# Altium schematic sheet dacOut.SchDoc
size A4
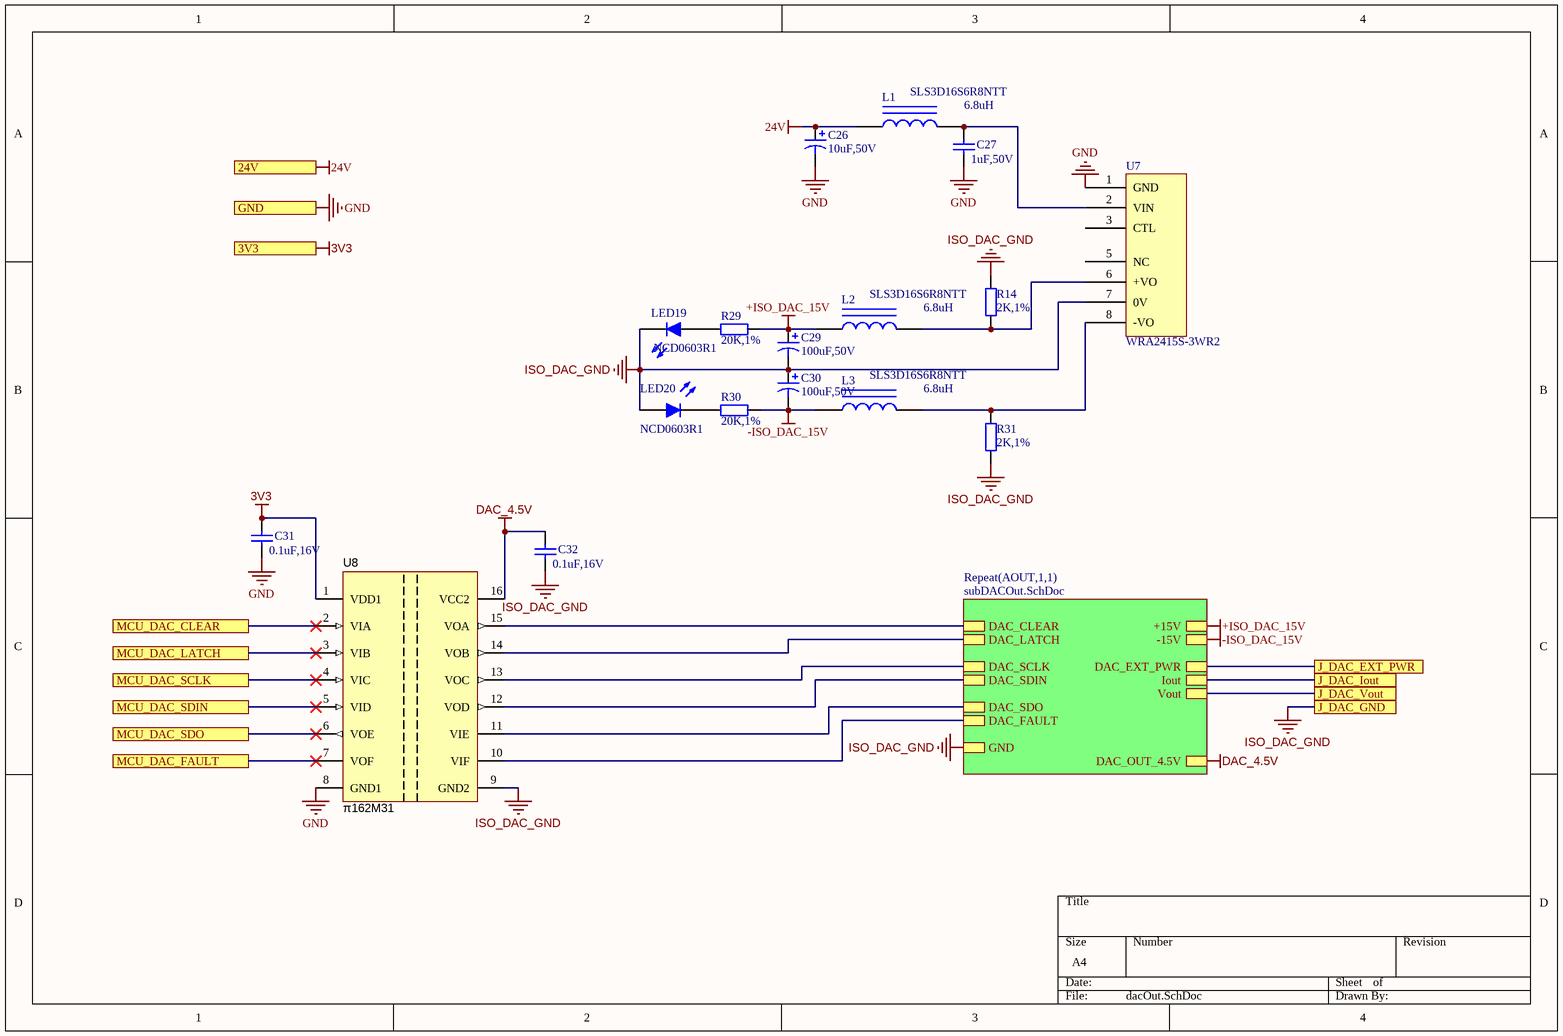
[diagram p0: dacOut.SchDoc]

## Parts
C26  10uF,50V  [CAP-TH_BD5.0-P2.00-D0.8-FD]
C27  1uF,50V  [C0603]
C29  100uF,50V  [CAP-TH_BD6.3-P2.50-D1.0-FD]
C30  100uF,50V  [CAP-TH_BD6.3-P2.50-D1.0-FD]
C31  0.1uF,16V  [C0603]
C32  0.1uF,16V  [C0603]
L1  SLS3D16S6R8NTT  value 6.8uH  [IND-SMD_L4.0-W4.0_SLS3DXX]
L2  SLS3D16S6R8NTT  value 6.8uH  [IND-SMD_L4.0-W4.0_SLS3DXX]
L3  SLS3D16S6R8NTT  value 6.8uH  [IND-SMD_L4.0-W4.0_SLS3DXX]
LED19  NCD0603R1  [LED0603-RD]
LED20  NCD0603R1  [LED0603-RD]
R14  2K,1%  [R0603]
R29  20K,1%  [R0603]
R30  20K,1%  [R0603]
R31  2K,1%  [R0603]
U7  WRA2415S-3WR2  [PWRM-TH_WRA2415S-3WR2]
U8  π162M31  [SOIC-16_L9.9-W3.9-P1.27-LS6.0-BL]

## Sub-sheets
Repeat(AOUT,1,1) = subDACOut.SchDoc: GND, Vout, -15V, +15V, DAC_EXT_PWR, Iout, DAC_OUT_4.5V, DAC_CLEAR, DAC_LATCH, DAC_FAULT, DAC_SDO, DAC_SCLK, DAC_SDIN

## Ports
3V3, 24V, GND, J_DAC_EXT_PWR, J_DAC_GND, J_DAC_Iout, J_DAC_Vout, MCU_DAC_CLEAR, MCU_DAC_FAULT, MCU_DAC_LATCH, MCU_DAC_SCLK, MCU_DAC_SDIN, MCU_DAC_SDO

## Nets
3V3: C31.2 U8.1(VDD1) ; port 3V3
24V: C26.1 L1.1 ; port 24V
+ISO_DAC_15V: C29.1 L2.1 R29.2 ; sheet Repeat(AOUT,1,1)/+15V
-ISO_DAC_15V: C30.2 L3.1 R30.2 ; sheet Repeat(AOUT,1,1)/-15V
DAC_4.5V: C32.2 U8.16(VCC2) ; sheet Repeat(AOUT,1,1)/DAC_OUT_4.5V
GND: C26.2 C27.1 C31.1 U7.1(GND) U8.8(GND1) ; port GND
ISO_DAC_GND: C29.2 C30.1 C32.1 LED19.1(K) LED20.2(A) R14.2 R31.1 U7.7(0V) U8.9(GND2) ; port J_DAC_GND, sheet Repeat(AOUT,1,1)/GND
J_DAC_EXT_PWR: port J_DAC_EXT_PWR, sheet Repeat(AOUT,1,1)/DAC_EXT_PWR
J_DAC_Iout: port J_DAC_Iout, sheet Repeat(AOUT,1,1)/Iout
J_DAC_Vout: port J_DAC_Vout, sheet Repeat(AOUT,1,1)/Vout
MCU_DAC_CLEAR: U8.2(VIA) ; port MCU_DAC_CLEAR
MCU_DAC_FAULT: U8.7(VOF) ; port MCU_DAC_FAULT
MCU_DAC_LATCH: U8.3(VIB) ; port MCU_DAC_LATCH
MCU_DAC_SCLK: U8.4(VIC) ; port MCU_DAC_SCLK
MCU_DAC_SDIN: U8.5(VID) ; port MCU_DAC_SDIN
MCU_DAC_SDO: U8.6(VOE) ; port MCU_DAC_SDO
NetC27_2: C27.2 L1.2 U7.2(VIN)
NetL2_2: L2.2 R14.1 U7.6(+VO)
NetL3_2: L3.2 R31.2 U7.8(-VO)
NetLED19_2: LED19.2(A) R29.1
NetLED20_1: LED20.1(K) R30.1
NetU8_10: U8.10(VIF) ; sheet Repeat(AOUT,1,1)/DAC_FAULT
NetU8_11: U8.11(VIE) ; sheet Repeat(AOUT,1,1)/DAC_SDO
NetU8_12: U8.12(VOD) ; sheet Repeat(AOUT,1,1)/DAC_SDIN
NetU8_13: U8.13(VOC) ; sheet Repeat(AOUT,1,1)/DAC_SCLK
NetU8_14: U8.14(VOB) ; sheet Repeat(AOUT,1,1)/DAC_LATCH
NetU8_15: U8.15(VOA) ; sheet Repeat(AOUT,1,1)/DAC_CLEAR

Not connected (* = marked no-connect by the designer): U7 3(CTL) 5(NC)

## Library data of the parts
C26 = 有极电容: Value: 100UF
C27 C31 C32 = 无极电容: Value: 104, 16V; Type: 贴片电容
C29 C30 = 有极电容: Value: 100UF
L1-L3 = Inductor Iron: Magnetic-Core Inductor; Published: 24-Mar-1999; LatestRevisionDate: 17-Jul-2002; LatestRevisionNote: Re-released for DXP Platform.; PackageReference: AXIAL-0.9; Publisher: Altium Limited; PackageDescription: Axial Device, Thru-Hole; 2 Leads; 0.9 in Pin Spacing
LED19 LED20 = LED0603: Typical INFRARED GaAs LED
R14 R29-R31 = 电阻: Value: 3.3K, 10%; Type: 贴片电阻
U7 = WRA2415S-3WR2: 3W，宽电压输入，隔离稳压正负双路/单路输出 DC/DC 模块电源
U8 = π162M31: Robust EMC, Low Power, 4 Out Channel, 2 Input Channel Digital Isolators.; ComponentLink1Description: Datasheet Link; ComponentLink1URL: http://www.ti.com/lit/ds/symlink/iso7340c.pdf